# Altium schematic sheet CLOCK_TRIGGER_BUF_SMA.SchDoc
size C; CompanyName: Atom Computing; Organization: Altium Limited; Address1: 918 Parker St.; Address2: Suite A-13; Address3: Berkeley, CA; Address4: 94710; Revision: B.2; SheetNumber: 3; SheetTotal: 4; PageSetup: Record=PageOptions|CenterHorizontal=True|CenterVertical=True|PrintScale=1.09|XCorrection=1.00|YCorrection=1.00|PrintKind=1|BorderSize=5000000|LeftOffset=0|BottomOffset=0|Orientation=2|PaperLength=4318|PaperWidth=2794|Scale=100|PaperSource=1025|PrintQuality=600|MediaType=256|DitherType=0|PrintScaleMode=1|PaperKind=11" x 17"|PaperIndex=17; Size: C; DescriptionA: ENGINEERING RELEASE; ReleaseYear: 2024; BoardTitle: MICRO HDMI INTERFACE
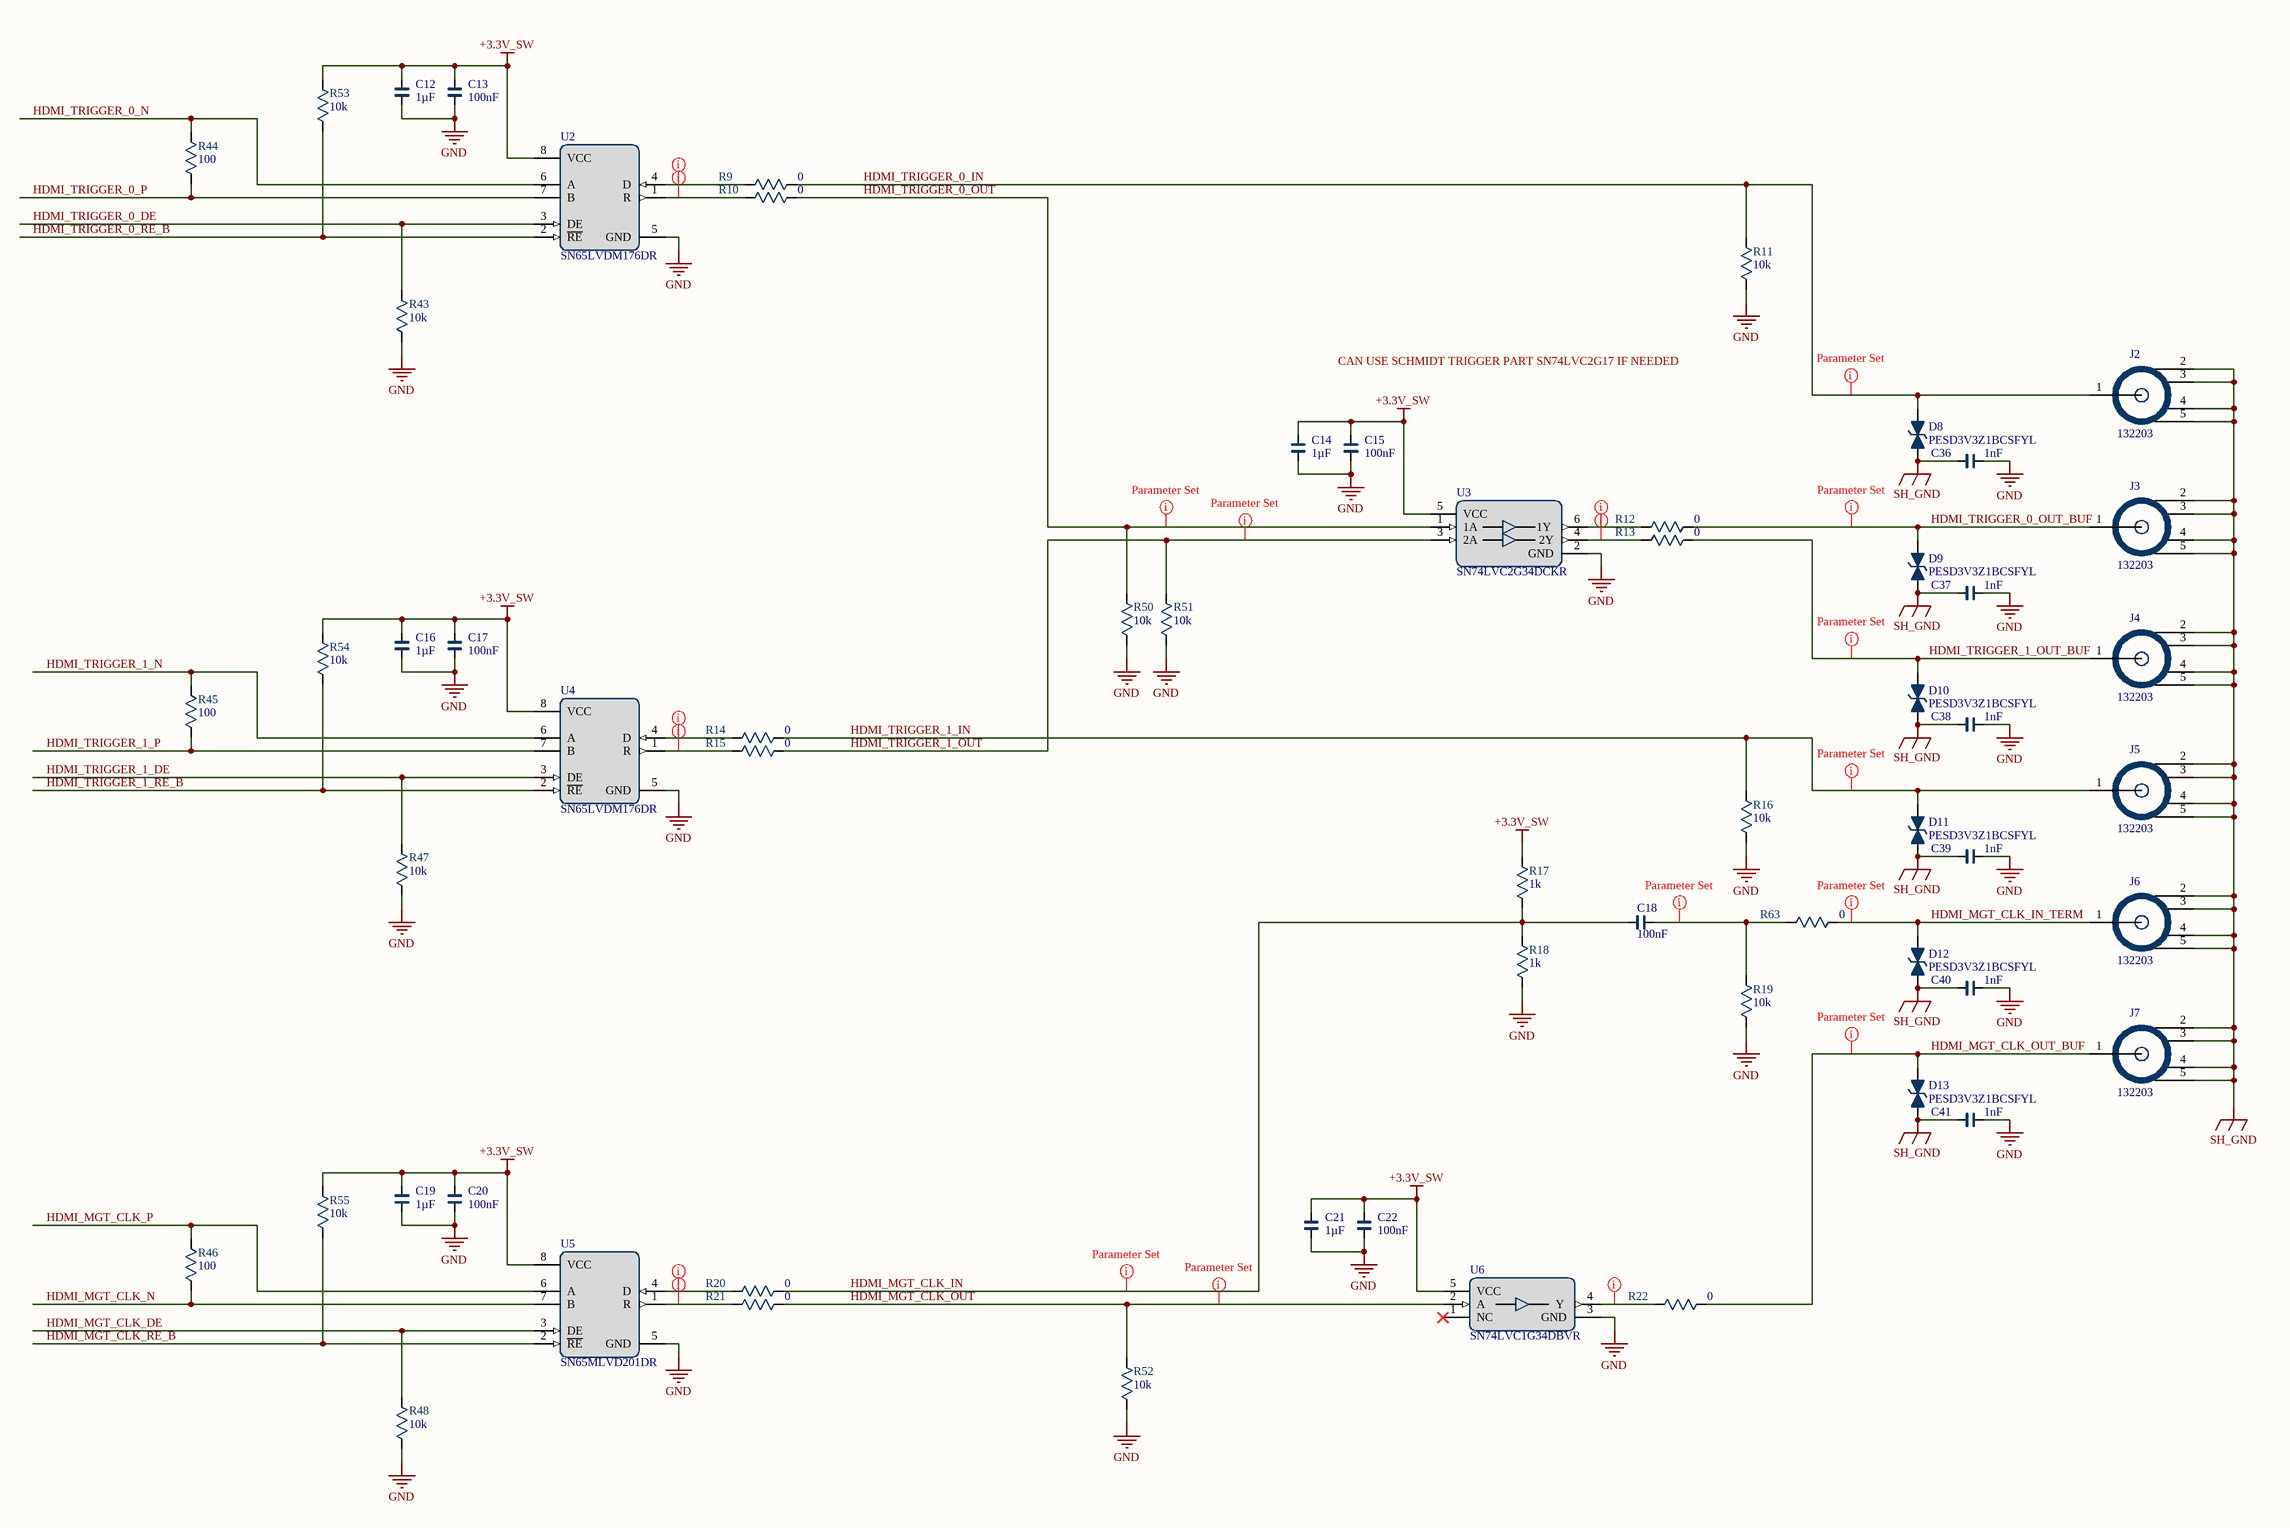
[diagram p0: CLOCK_TRIGGER_BUF_SMA.SchDoc]

## Parts
C12  1µF  [CAPC160X80X95L35]
C13  100nF  [CAPC160X80X95L35]
C14  1µF  [CAPC160X80X95L35]
C15  100nF  [CAPC160X80X95L35]
C16  1µF  [CAPC160X80X95L35]
C17  100nF  [CAPC160X80X95L35]
C18  100nF  [CAPC160X80X95L35]
C19  1µF  [CAPC160X80X95L35]
C20  100nF  [CAPC160X80X95L35]
C21  1µF  [CAPC160X80X95L35]
C22  100nF  [CAPC160X80X95L35]
C36  1nF  [CAPC160X80X95L35]
C37  1nF  [CAPC160X80X95L35]
C38  1nF  [CAPC160X80X95L35]
C39  1nF  [CAPC160X80X95L35]
C40  1nF  [CAPC160X80X95L35]
C41  1nF  [CAPC160X80X95L35]
D8  PESD3V3Z1BCSFYL  [DIO_PESD5V0R1BSFYL]
D9  PESD3V3Z1BCSFYL  [DIO_PESD5V0R1BSFYL]
D10  PESD3V3Z1BCSFYL  [DIO_PESD5V0R1BSFYL]
D11  PESD3V3Z1BCSFYL  [DIO_PESD5V0R1BSFYL]
D12  PESD3V3Z1BCSFYL  [DIO_PESD5V0R1BSFYL]
D13  PESD3V3Z1BCSFYL  [DIO_PESD5V0R1BSFYL]
J2  132203  [Amphenol_132203]
J3  132203  [Amphenol_132203]
J4  132203  [Amphenol_132203]
J5  132203  [Amphenol_132203]
J6  132203  [Amphenol_132203]
J7  132203  [Amphenol_132203]
R9  0  [RESC160X85X55L30]
R10  0  [RESC160X85X55L30]
R11  10k  [RESC160X85X55L30]
R12  0  [RESC160X85X55L30]
R13  0  [RESC160X85X55L30]
R14  0  [RESC160X85X55L30]
R15  0  [RESC160X85X55L30]
R16  10k  [RESC160X85X55L30]
R17  1k  [RESC160X85X55L30]
R18  1k  [RESC160X85X55L30]
R19  10k  [RESC160X85X55L30]
R20  0  [RESC160X85X55L30]
R21  0  [RESC160X85X55L30]
R22  0  [RESC160X85X55L30]
R43  10k  [RESC160X85X55L30]
R44  100  [RESC160X85X55L30]
R45  100  [RESC160X85X55L30]
R46  100  [RESC160X85X55L30]
R47  10k  [RESC160X85X55L30]
R48  10k  [RESC160X85X55L30]
R50  10k  [RESC160X85X55L30]
R51  10k  [RESC160X85X55L30]
R52  10k  [RESC160X85X55L30]
R53  10k  [RESC160X85X55L30]
R54  10k  [RESC160X85X55L30]
R55  10k  [RESC160X85X55L30]
R63  0  [RESC160X85X55L30]
U2  SN65LVDM176DR  [SOIC8P127_490X599X175L84X41]
U3  SN74LVC2G34DCKR  [SOT23-6P65_210X110L36X23]
U4  SN65LVDM176DR  [SOIC8P127_490X599X175L84X41]
U5  SN65MLVD201DR  [SOIC8P127_490X599X175L84X41]
U6  SN74LVC1G34DBVR  [SOT23-5P95_280X110L45X40]

## Nets
+3.3V_SW: C12.1 C13.1 C14.1 C15.1 C16.1 C17.1 C19.1 C20.1 C21.1 C22.1 R17.2 R53.2 R54.2 R55.2 U2.8(VCC) U3.5(VCC) U4.8(VCC) U5.8(VCC) U6.5(VCC)
GND: C12.2 C13.2 C14.2 C15.2 C16.2 C17.2 C19.2 C20.2 C21.2 C22.2 C36.1 C37.1 C38.1 C39.1 C40.1 C41.1 R11.1 R16.1 R18.1 R19.1 R43.1 R47.1 R48.1 R50.1 R51.1 R52.1 U2.5(GND) U3.2(GND) U4.5(GND) U5.5(GND) U6.3(GND)
SH_GND: C36.2 C37.2 C38.2 C39.2 C40.2 C41.2 D8.1 D9.1 D10.1 D11.1 D12.1 D13.1 J2.2(GND) J2.3(GND) J2.4(GND) J2.5(GND) J3.2(GND) J3.3(GND) J3.4(GND) J3.5(GND) J4.2(GND) J4.3(GND) J4.4(GND) J4.5(GND) J5.2(GND) J5.3(GND) J5.4(GND) J5.5(GND) J6.2(GND) J6.3(GND) J6.4(GND) J6.5(GND) J7.2(GND) J7.3(GND) J7.4(GND) J7.5(GND)
HDMI_MGT_CLK_DE: R48.2 U5.3(DE)
HDMI_MGT_CLK_IN: C18.1 R17.1 R18.2 R20.2
HDMI_MGT_CLK_IN_TERM: D12.2 J6.1(RF) R63.2
HDMI_MGT_CLK_N: R46.1 U5.7(B)
HDMI_MGT_CLK_OUT: R21.2 R52.2 U6.2(A)
HDMI_MGT_CLK_OUT_BUF: D13.2 J7.1(RF) R22.2
HDMI_MGT_CLK_P: R46.2 U5.6(A)
HDMI_MGT_CLK_RE_B: R55.1 U5.2(~{RE})
HDMI_TRIGGER_0_DE: R43.2 U2.3(DE)
HDMI_TRIGGER_0_IN: D8.2 J2.1(RF) R9.2 R11.2
HDMI_TRIGGER_0_N: R44.2 U2.6(A)
HDMI_TRIGGER_0_OUT: R10.2 R50.2 U3.1(1A)
HDMI_TRIGGER_0_OUT_BUF: D9.2 J3.1(RF) R12.2
HDMI_TRIGGER_0_P: R44.1 U2.7(B)
HDMI_TRIGGER_0_RE_B: R53.1 U2.2(~{RE})
HDMI_TRIGGER_1_DE: R47.2 U4.3(DE)
HDMI_TRIGGER_1_IN: D11.2 J5.1(RF) R14.2 R16.2
HDMI_TRIGGER_1_N: R45.2 U4.6(A)
HDMI_TRIGGER_1_OUT: R15.2 R51.2 U3.3(2A)
HDMI_TRIGGER_1_OUT_BUF: D10.2 J4.1(RF) R13.2
HDMI_TRIGGER_1_P: R45.1 U4.7(B)
HDMI_TRIGGER_1_RE_B: R54.1 U4.2(~{RE})
NetC18_2: C18.2 R19.2 R63.1
NetR9_1: R9.1 U2.4(D)
NetR10_1: R10.1 U2.1(R)
NetR12_1: R12.1 U3.6(1Y)
NetR13_1: R13.1 U3.4(2Y)
NetR14_1: R14.1 U4.4(D)
NetR15_1: R15.1 U4.1(R)
NetR20_1: R20.1 U5.4(D)
NetR21_1: R21.1 U5.1(R)
NetR22_1: R22.1 U6.4(Y)

Not connected (* = marked no-connect by the designer): U6 1(NC)*

## Layout directives
net class 50OHM: HDMI_MGT_CLK_IN, HDMI_MGT_CLK_IN_TERM, HDMI_MGT_CLK_OUT, HDMI_MGT_CLK_OUT_BUF, HDMI_TRIGGER_0_IN, HDMI_TRIGGER_0_OUT, HDMI_TRIGGER_0_OUT_BUF, HDMI_TRIGGER_1_IN, HDMI_TRIGGER_1_OUT, HDMI_TRIGGER_1_OUT_BUF, NetC18_2, NetR9_1, NetR10_1, NetR12_1, NetR13_1, NetR14_1, NetR15_1, NetR20_1, NetR21_1, NetR22_1

## Notes on the sheet
- CAN USE SCHMIDT TRIGGER PART SN74LVC2G17 IF NEEDED
- SCHEMATIC,
- "This documentation describes Open Hardware and is licensed under the CC BY-SA 4.0. You may redistribute and modify this documentation under the terms of
- CC BY-SA 4.0. (https://creativecommons.org/licenses/by-sa/4.0/). This documentation is distributed WITHOUT ANY EXPRESS OR IMPLIED WARRANTY,
- INCLUDING OF MERCHANTABILITY, SATISFACTORY QUALITY AND FITNESS FOR A PARTICULAR PURPOSE."  COPYRIGHT ©
- Atom Computing, Inc.
- ,
- SIZE
- FILE NAME
- PAGE
- OF
- REV

## Library data of the parts
C12 C14 C16 C19 C21 = CMP-001-00135-7: CAP CER 1uF 10V 10% 0603; Op Temp: -55°C ~ 85°C; Mfg PN: C0603C105K8PACTU; Temp Coeff: X5R; Mfg: Kemet; VALUE: 1µF; Voltage: 10V; Tolerance: 10%; Case/Package: 0603; Pins: 2
C13 C15 C17 C18 C20 C22 = CMP-001-00143-7: CAP CER 0.1UF 25V X7R 0603; Tolerance: 10%; Mfg: Kemet; Mfg PN: C0603X104K3RACTU; Voltage: 25V; Temp Coeff: X7R; Case/Package: 0603; VALUE: 100nF; Pins: 2
C36-C41 = CMP-001-00209-7: CAP CER 1000PF 50V C0G/NPO 0603; Temp Coeff: C0G/NP0; Tolerance: 5%; Mfg: Yageo; Mfg PN: CC0603JRNPO9BN102; Voltage: 50V; Case/Package: 0603; Pins: 2; VALUE: 1nF
D8-D13 = CMP-037-00000-1: TVS DIODE 3.3VWM 4.8VC DSN0603-2; Voltage-Clamping: 4.8V; Voltage-Reverse Standoff: 3.3V; Mfg: Nexperia USA Inc.; Voltage-Breakdown: 6.8V; Current-Peak Pulse: 15A (8/20µs); RoHS Compliant: Yes; Max Operating Temperature: 125°C; Case/Package: 0201; Pins: 2; Min Operating Temperature: -40°C; Mfg PN: PESD3V3Z1BCSFYL; Mounting Technology: Surface Mount
J2-J7 = CMP-002-00003-3: Conn; RF; SMA Rt Angle PCB Jack Thru Hole 50 Ohm Bulkhead; Mfg: Amphenol RF; Case/Package: SMA RA; Mfg PN: 132203; Pins: 5
R9 R10 R12-R15 R20-R22 R63 = CMP-009-00290-2: RES 0 OHM JUMPER 1/10W 0603; Mfg PN: RC0603FR-070RL; Mfg: Yageo; Case/Package: 0603; Pins: 2; VALUE: 0
R11 R16 R19 R43 R47 R48 R50-R55 = CMP-009-00475-2: RES SMD 10K OHM 1% 1/10W 0603; Power: 100mW; Mfg PN: ERJ-3EKF1002V; Mfg: Panasonic Electronic Components; Mounting Technology: Surface Mount; RoHS Compliant: Yes; Case/Package: 0603; Min Operating Temperature: -55°C; VALUE: 10k; Max Operating Temperature: 155°C; Tolerance: 1%; Pins: 2
R17 R18 = CMP-009-00295-2: RES SMD 1K OHM 1% 1/10W 0603; Mfg PN: RC0603FR-071KL; Mfg: Yageo; VALUE: 1k; Case/Package: 0603; Pins: 2
R44-R46 = CMP-009-00467-2: RES SMD 100 OHM 1% 1/10W 0603; Power: 100mW; Mfg PN: ERJ-3EKF1000V; Mfg: Panasonic Electronic Components; VALUE: 100; Pins: 2; Case/Package: 0603; RoHS Compliant: Yes; Mounting Technology: Surface Mount; Tolerance: 1%; Min Operating Temperature: -55°C; Max Operating Temperature: 155°C
U2 U4 = CMP-015-00015-3: 1/1 Transceiver Half LVDS 8-SOIC; Max Supply Voltage: 3.6V; Mfg: Texas Instruments; Nominal Supply Voltage: 3.3V; Min Supply Voltage: 3V; Mfg PN: SN65LVDM176DR; Max Operating Temperature: 85°C; Min Operating Temperature: -40°C; Pins: 8; Case/Package: SOP; RoHS Compliant: Yes; Mounting Technology: Surface Mount
U3 = CMP-016-00001-4: Buffer, Non-Inverting 2 Element 1 Bit per Element Push-Pull Output SC-70-6; Min Supply Voltage: 1.65V; Frequency: 125MHz; Mfg: Texas Instruments; Max Supply Voltage: 5.5V; Min Operating Temperature: -40°C; Logic Type: Buffer; Mfg PN: SN74LVC2G34DCKR; Pins: 6; RoHS Compliant: Yes; Mounting Technology: Surface Mount; Max Operating Temperature: 125°C; Case/Package: SC-70-6
U5 = CMP-015-00016-3: 1/1 Transceiver Half LVDS, Multipoint 8-SOIC; Max Supply Voltage: 3.6V; Min Supply Voltage: 3V; Nominal Supply Voltage: 3.3V; Mfg: Texas Instruments; Max Operating Temperature: 85°C; RoHS Compliant: Yes; Pins: 8; Case/Package: SOP; Min Operating Temperature: -40°C; Mfg PN: SN65MLVD201DR; Mounting Technology: Surface Mount
U6 = CMP-016-00004-1: Buffer, Non-Inverting 1 Element 1 Bit per Element Push-Pull Output SOT-23-5; Max Supply Voltage: 5.5V; Mfg: Texas Instruments; Min Supply Voltage: 1.65V; Nominal Supply Voltage: 3.3V; Pins: 5; RoHS Compliant: Yes; Output Function: Buffer, Non-Inverting; Logic Type: BUFFER; Case/Package: LSSOP; Mounting Technology: Surface Mount; Max Operating Temperature: 125°C; Min Operating Temperature: -40°C; Mfg PN: SN74LVC1G34DBVR